# Altium schematic sheet Fleet-Monitor-Overview.SchDoc: Fleet Monitor
size A4; Subtitle: Overview; DocumentNumber: 1; Revision: V1.0; SheetNumber: 1; SheetTotal: 8; Author: Florian Baumgarnter & Luca Jost
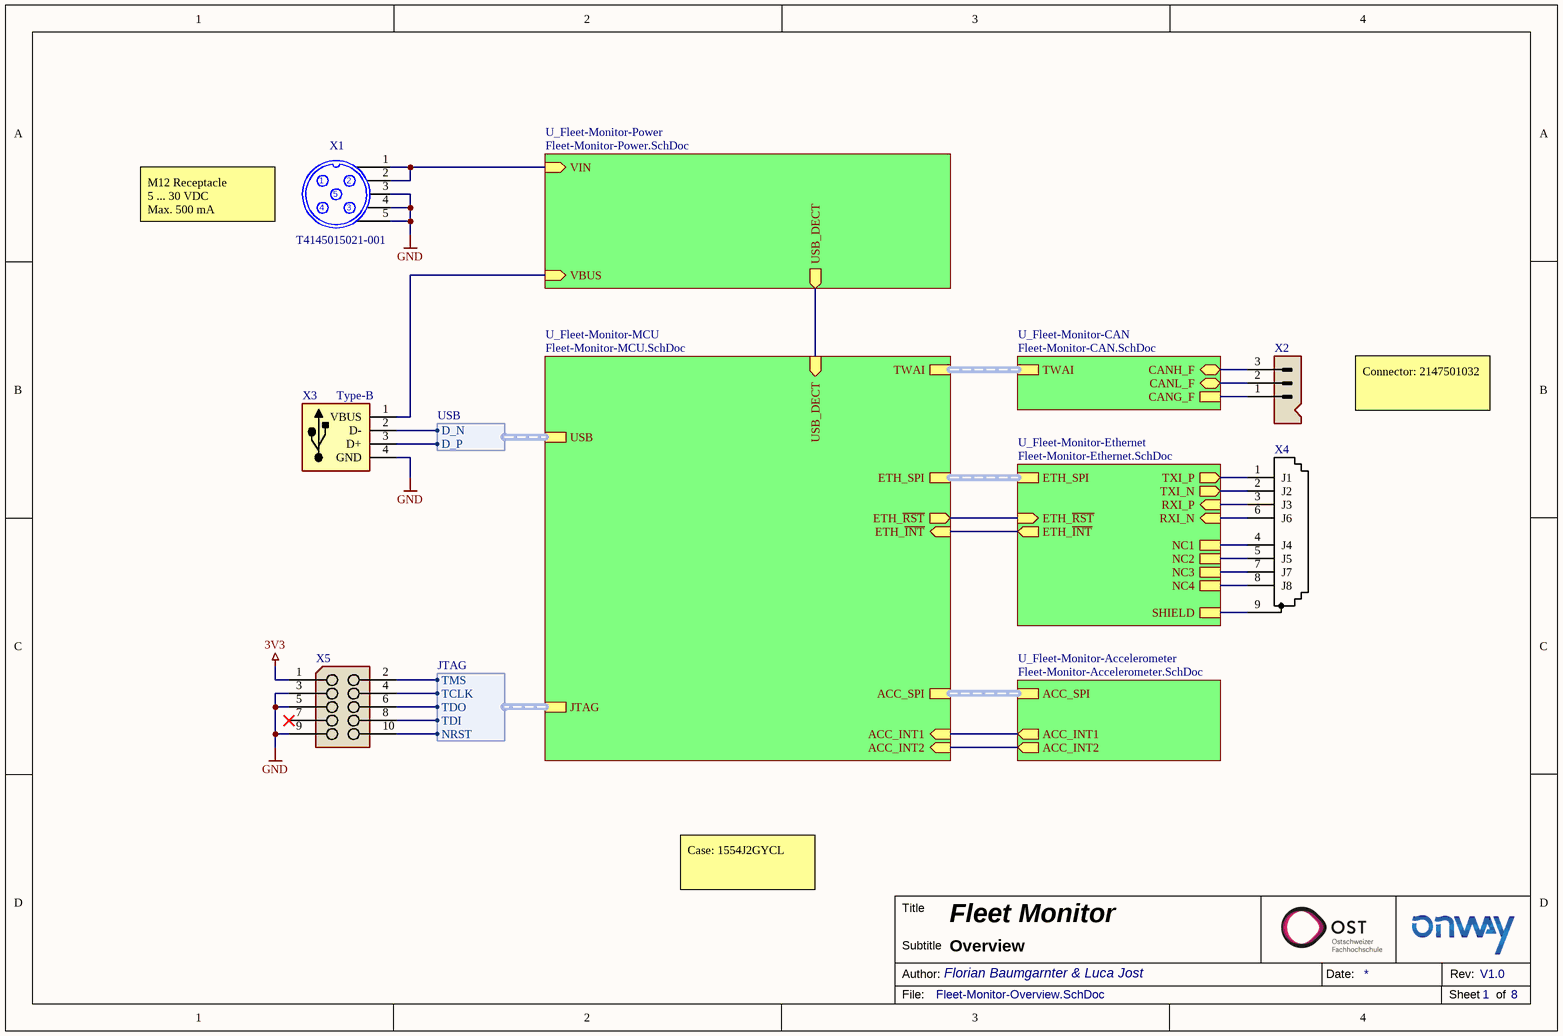
[diagram p0: Fleet-Monitor-Overview.SchDoc]

## Parts
X1  T4145015021-001  [THT Connector M12]
X2  Pin Header Through Hole Wire To Board  [THT Connector 0436500315]  (value not drawn)
X3  Type-B  [THT Connector MUSBD111M5]
X4  NE8FDH-C5E-TOP  [THT Connector NE8FDH-C5E-TOP]  (value not drawn)
X5  JTAG-Header (ARM-Cortex)  [SMD Connector 1.27mm (2x5)]  (value not drawn)

## Sub-sheets
U_Fleet-Monitor-Accelerometer = Fleet-Monitor-Accelerometer.SchDoc: ACC_SPI (harness SPI), ACC_INT1 (out), ACC_INT2 (out)
U_Fleet-Monitor-CAN = Fleet-Monitor-CAN.SchDoc: TWAI (harness TWAI), CANH_F (bidir), CANL_F (bidir), CANG_F
U_Fleet-Monitor-Ethernet = Fleet-Monitor-Ethernet.SchDoc: NC1, ETH_SPI (harness SPI), TXI_P (out), TXI_N (out), RXI_P (in), RXI_N (in), ETH_~{RST} (in), ETH_~{INT} (out), NC2, NC3, NC4, SHIELD
U_Fleet-Monitor-MCU = Fleet-Monitor-MCU.SchDoc: USB (harness USB), JTAG (harness JTAG), ETH_SPI (harness SPI), TWAI (harness TWAI), ACC_INT1 (in), ACC_INT2 (in), ETH_~{RST} (out), ETH_~{INT} (in), ACC_SPI (harness SPI), USB_DECT (in)
U_Fleet-Monitor-Power = Fleet-Monitor-Power.SchDoc: VBUS (in), VIN (in), USB_DECT (out)

## Harnesses
JTAG: TMS, TDI, TDO, TCLK, NRST
USB: D_P, D_N

## Nets
3V3: X5.1
GND: X1.3 X1.4 X1.5 X3.4(GND) X5.3 X5.5 X5.9
NetX1_1: X1.1 X1.2 ; sheet U_Fleet-Monitor-Power/VIN
NetX2_1: X2.1 ; sheet U_Fleet-Monitor-CAN/CANG_F
NetX2_2: X2.2 ; sheet U_Fleet-Monitor-CAN/CANL_F
NetX2_3: X2.3 ; sheet U_Fleet-Monitor-CAN/CANH_F
NetX3_1: X3.1(VBUS) ; sheet U_Fleet-Monitor-Power/VBUS
NetX3_2: X3.2(D-) ; sheet U_Fleet-Monitor-MCU/USB.D_N
NetX3_3: X3.3(D+) ; sheet U_Fleet-Monitor-MCU/USB.D_P
NetX4_1: X4.1 ; sheet U_Fleet-Monitor-Ethernet/TXI_P
NetX4_2: X4.2 ; sheet U_Fleet-Monitor-Ethernet/TXI_N
NetX4_3: X4.3 ; sheet U_Fleet-Monitor-Ethernet/RXI_P
NetX4_4: X4.4 ; sheet U_Fleet-Monitor-Ethernet/NC1
NetX4_5: X4.5 ; sheet U_Fleet-Monitor-Ethernet/NC2
NetX4_6: X4.6 ; sheet U_Fleet-Monitor-Ethernet/RXI_N
NetX4_7: X4.7 ; sheet U_Fleet-Monitor-Ethernet/NC3
NetX4_8: X4.8 ; sheet U_Fleet-Monitor-Ethernet/NC4
NetX4_9: X4.9 ; sheet U_Fleet-Monitor-Ethernet/SHIELD
NetX5_2: X5.2 ; sheet U_Fleet-Monitor-MCU/JTAG.TMS
NetX5_4: X5.4 ; sheet U_Fleet-Monitor-MCU/JTAG.TCLK
NetX5_6: X5.6 ; sheet U_Fleet-Monitor-MCU/JTAG.TDO
NetX5_8: X5.8 ; sheet U_Fleet-Monitor-MCU/JTAG.TDI
NetX5_10: X5.10 ; sheet U_Fleet-Monitor-MCU/JTAG.NRST
(unnamed): sheet U_Fleet-Monitor-Ethernet/ETH_~{RST}, sheet U_Fleet-Monitor-MCU/ETH_~{RST}
(unnamed): sheet U_Fleet-Monitor-Ethernet/ETH_~{INT}, sheet U_Fleet-Monitor-MCU/ETH_~{INT}
(unnamed): sheet U_Fleet-Monitor-Accelerometer/ACC_INT1, sheet U_Fleet-Monitor-MCU/ACC_INT1
(unnamed): sheet U_Fleet-Monitor-Accelerometer/ACC_INT2, sheet U_Fleet-Monitor-MCU/ACC_INT2
(unnamed): sheet U_Fleet-Monitor-Power/USB_DECT, sheet U_Fleet-Monitor-MCU/USB_DECT

Not connected (* = marked no-connect by the designer): X5 7*

## Buses and harness runs
harness sheet U_Fleet-Monitor-Accelerometer/ACC_SPI = sheet U_Fleet-Monitor-MCU/ACC_SPI
harness sheet U_Fleet-Monitor-CAN/TWAI = sheet U_Fleet-Monitor-MCU/TWAI
harness sheet U_Fleet-Monitor-Ethernet/ETH_SPI = sheet U_Fleet-Monitor-MCU/ETH_SPI

## Notes on the sheet
- M12 Receptacle
  5 ... 30 VDC
  Max. 500 mA
- Connector: 2147501032
- Case: 1554J2GYCL
- Title
- Author:
- Subtitle
- Date:
- Rev:
- File:
- Sheet
- of
- (in symbol NE8FDH-C5E-TOP) J1; J2; J3; J6; J4; J5; J7; J8

## Library data of the parts
X1 = T4145015021: M12 Receptacle Connector PCB Assembly; ComponentLink1Description: Datasheet; ComponentLink1URL: https://www.te.com/commerce/DocumentDelivery/DDEController?Action=srchrtrv&DocNm=T41450150X1001&DocType=Customer+Drawing&DocLang=English; Component Value: T4145015021-001; Digikey: A126521-ND; Unit Price: 6.97; Component Description: M12 Receptacle Connector PCB Assembly
X2 = X-Stiftleiste (3-Fach): Component Value: 436500315; Digikey: WM1918-ND; Farnell: 1654451; Mouser: 538-43650-0315; Unit Price: 0.38; ComponentLink1Description: Datasheet; ComponentLink1URL: https://datasheet.lcsc.com/lcsc/1912111437_MOLEX-436500315_C293546.pdf; JLC-Parts: C293546; Component Description: Pin Header Through Hole Wire To Board
X3 = X-USB-Buchse: Typ-B; Component Value: MUSBD111M5; Digikey: MUSBD111M5-ND; Farnell: 3728524; Mouser: 523-MUSBD111M5; Unit Price: 11.17; ComponentLink1Description: Datasheet; ComponentLink1URL: https://www.amphenol-icc.com/media/wysiwyg/files/drawing/musbd111xx.pdf; Component Description: USB-Buchse
X4 = NE8FDH-C5E-TOP: RJ45 etherCON IP65; Component Value: NE8FDH-C5E-TOP; Farnell: 3014323; Mouser: 568-NE8FDH-C5E-TOP; Unit Price: 12.83; ComponentLink1Description: Datasheet; ComponentLink1URL: https://www.mouser.ch/datasheet/2/289/ne8fdh_c5e_top-1853139.pdf; Component Description: RJ45 etherCON IP65
X5 = X-JTAG-Header (ARM-Cortex): Component Value: SHF-105-01-L-D-SM (2x5); Digikey: SAM10710-ND; Farnell: 1885915; Mouser: 200-SHF10501LDSM; Unit Price: 2.89; ComponentLink1Description: Datasheet; ComponentLink1URL: https://datasheet.lcsc.com/lcsc/1810170717_UNI-ROYAL-Uniroyal-Elec-4D03WGJ0331T5E_C12018.pdf; Component Description: JTAG-Header (ARM-Cortex)